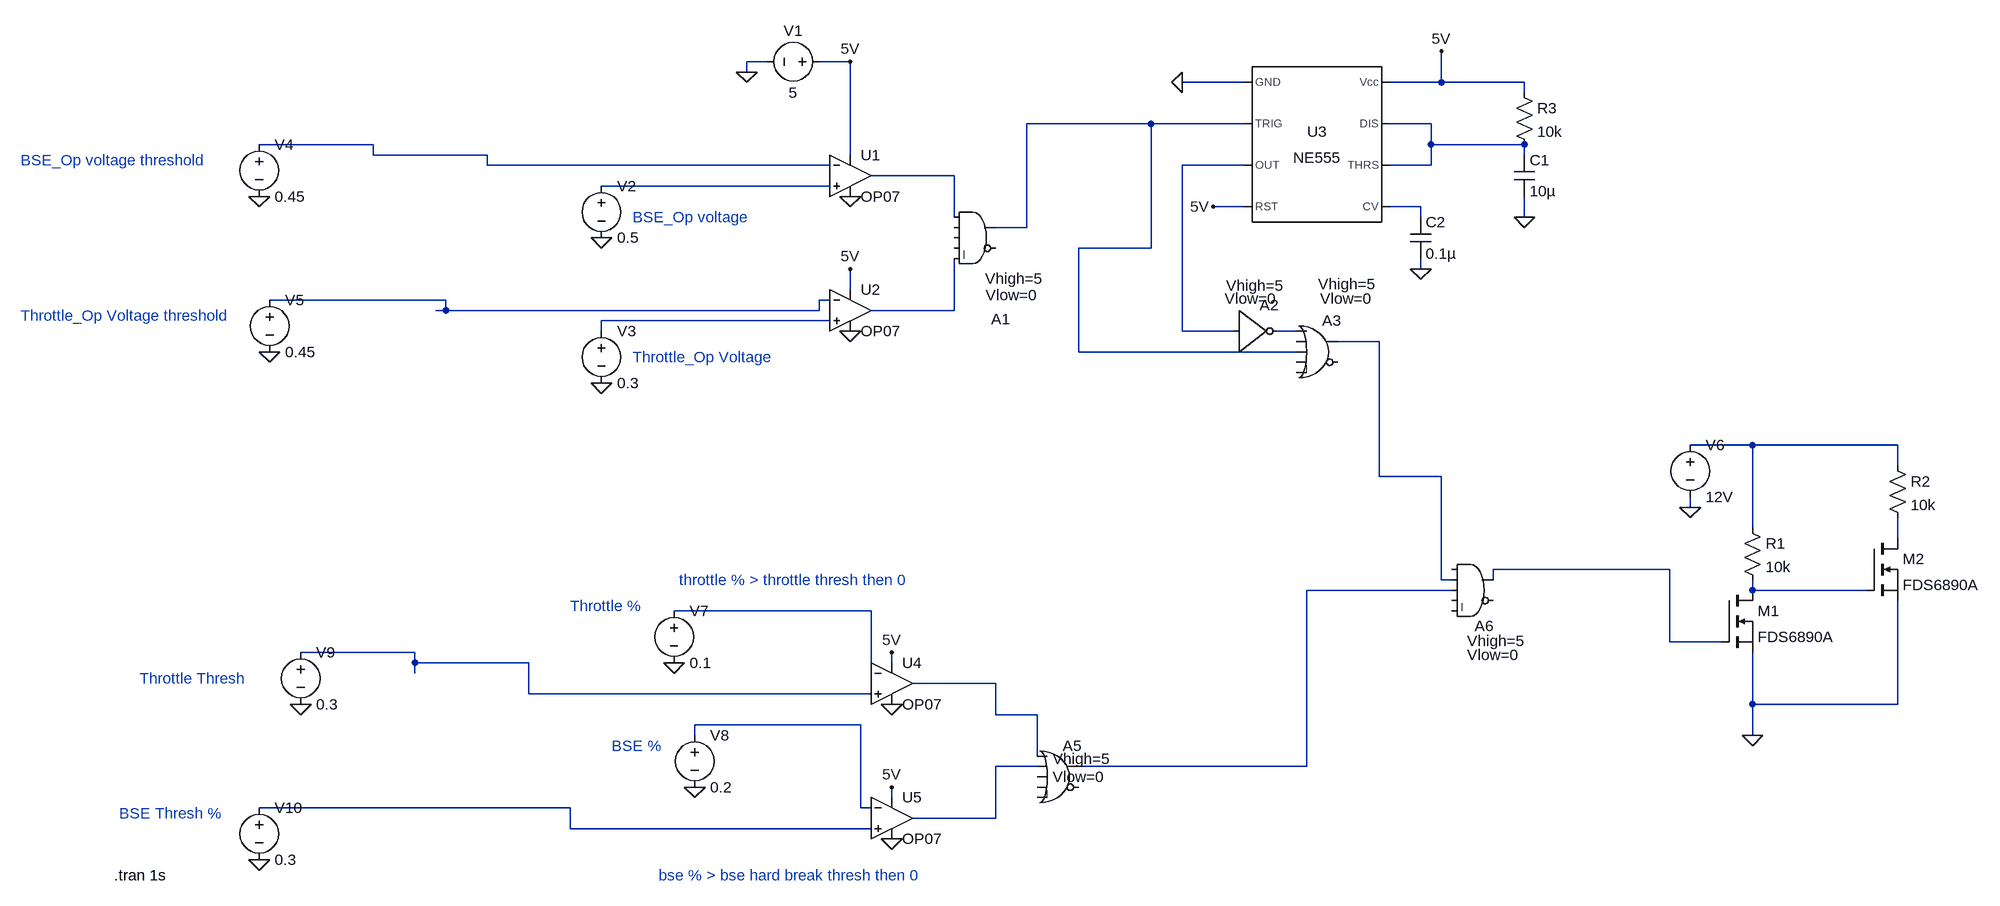
[diagram p0: schematic BSPD_Sim.asc]
BSPD_Sim.asc, the LTspice schematic file:
Version 4
SHEET 1 1992 1124
WIRE 0 -176 -32 -176
WIRE 128 -176 80 -176
WIRE -32 -160 -32 -176
WIRE 736 -144 640 -144
WIRE 1040 -144 1040 -192
WIRE 1040 -144 960 -144
WIRE 1168 -144 1040 -144
WIRE 1168 -128 1168 -144
WIRE 592 -80 400 -80
WIRE 736 -80 592 -80
WIRE 1024 -80 960 -80
WIRE -608 -48 -784 -48
WIRE 1024 -48 1024 -80
WIRE 1168 -48 1024 -48
WIRE -608 -32 -608 -48
WIRE -432 -32 -608 -32
WIRE 128 -32 128 -176
WIRE 1168 -32 1168 -48
WIRE -432 -16 -432 -32
WIRE 96 -16 -432 -16
WIRE 736 -16 640 -16
WIRE 1024 -16 1024 -48
WIRE 1024 -16 960 -16
WIRE 288 0 160 0
WIRE 96 16 -256 16
WIRE 736 48 688 48
WIRE 1008 48 960 48
WIRE 288 64 288 0
WIRE 1008 64 1008 48
WIRE 1168 64 1168 32
WIRE 400 80 400 -80
WIRE 400 80 352 80
WIRE 592 112 592 -80
WIRE 592 112 480 112
WIRE 1008 144 1008 128
WIRE 128 176 128 144
WIRE -496 192 -768 192
WIRE 96 192 80 192
WIRE -496 208 -496 192
WIRE -496 208 -512 208
WIRE 80 208 80 192
WIRE 80 208 -496 208
WIRE 288 208 288 128
WIRE 288 208 160 208
WIRE 96 224 -256 224
WIRE -256 240 -256 224
WIRE 640 240 640 -16
WIRE 720 240 640 240
WIRE 816 240 784 240
WIRE 944 256 880 256
WIRE 480 272 480 112
WIRE 816 272 480 272
WIRE 1520 416 1424 416
WIRE 1744 416 1520 416
WIRE 1744 448 1744 416
WIRE 944 464 944 256
WIRE 1040 464 944 464
WIRE 1424 512 1424 496
WIRE 1520 544 1520 416
WIRE 1744 560 1744 528
WIRE 1392 608 1120 608
WIRE 1040 624 1040 464
WIRE 1056 624 1040 624
WIRE 1120 624 1120 608
WIRE 1056 640 832 640
WIRE 1520 640 1520 624
WIRE 1696 640 1520 640
WIRE 160 672 -144 672
WIRE 1392 720 1392 608
WIRE 1472 720 1392 720
WIRE -544 736 -720 736
WIRE -544 752 -544 736
WIRE -368 752 -544 752
WIRE 192 752 192 736
WIRE -544 768 -544 752
WIRE 160 768 160 672
WIRE 352 784 224 784
WIRE -368 800 -368 752
WIRE 160 800 -368 800
WIRE 1520 816 1520 736
WIRE 1744 816 1744 656
WIRE 1744 816 1520 816
WIRE 352 832 352 784
WIRE 416 832 352 832
WIRE 144 848 -112 848
WIRE -112 864 -112 848
WIRE 1520 864 1520 816
WIRE 416 896 416 832
WIRE 416 912 352 912
WIRE 832 912 832 640
WIRE 832 912 480 912
WIRE 192 960 192 944
WIRE -304 976 -784 976
WIRE 144 976 144 848
WIRE 160 976 144 976
WIRE 352 992 352 912
WIRE 352 992 224 992
WIRE -304 1008 -304 976
WIRE 160 1008 -304 1008
FLAG 128 -176 5V
FLAG 128 144 5V
FLAG 128 32 0
FLAG -32 -160 0
FLAG 128 240 0
FLAG -256 320 0
FLAG -256 96 0
FLAG -784 32 0
FLAG -768 272 0
FLAG 192 816 0
FLAG 192 1024 0
FLAG -112 944 0
FLAG -144 752 0
FLAG -720 816 0
FLAG -784 1056 0
FLAG 192 736 5V
FLAG 192 944 5V
FLAG 1520 864 0
FLAG 1040 -192 5V
FLAG 1168 64 0
FLAG 640 -144 0
FLAG 1008 144 0
FLAG 688 48 5V
FLAG 1424 512 0
SYMBOL OpAmps\\OP07 128 -64 R0
SYMATTR InstName U1
SYMBOL OpAmps\\OP07 128 144 R0
SYMATTR InstName U2
SYMBOL voltage 96 -176 R90
WINDOW 0 -32 56 VBottom 2
WINDOW 3 32 56 VTop 2
SYMATTR InstName V1
SYMATTR Value 5
SYMBOL voltage -256 0 R0
WINDOW 123 0 0 Left 0
WINDOW 39 0 0 Left 0
SYMATTR InstName V2
SYMATTR Value 0.5
SYMBOL voltage -256 224 R0
WINDOW 123 0 0 Left 0
WINDOW 39 0 0 Left 0
SYMATTR InstName V3
SYMATTR Value 0.3
SYMBOL voltage -784 -64 R0
WINDOW 123 0 0 Left 0
WINDOW 39 0 0 Left 0
SYMATTR InstName V4
SYMATTR Value 0.45
SYMBOL voltage -768 176 R0
WINDOW 123 0 0 Left 0
WINDOW 39 0 0 Left 0
SYMATTR InstName V5
SYMATTR Value 0.45
SYMBOL OpAmps\\OP07 192 720 R0
SYMATTR InstName U4
SYMBOL OpAmps\\OP07 192 928 R0
SYMATTR InstName U5
SYMBOL voltage -144 656 R0
WINDOW 123 0 0 Left 0
WINDOW 39 0 0 Left 0
SYMATTR InstName V7
SYMATTR Value 0.1
SYMBOL voltage -112 848 R0
WINDOW 123 0 0 Left 0
WINDOW 39 0 0 Left 0
SYMATTR InstName V8
SYMATTR Value 0.2
SYMBOL voltage -720 720 R0
WINDOW 123 0 0 Left 0
WINDOW 39 0 0 Left 0
SYMATTR InstName V9
SYMATTR Value 0.3
SYMBOL voltage -784 960 R0
WINDOW 123 0 0 Left 0
WINDOW 39 0 0 Left 0
SYMATTR InstName V10
SYMATTR Value 0.3
SYMBOL Digital\\and 320 32 R0
WINDOW 39 16 127 Left 2
WINDOW 40 17 152 Left 2
WINDOW 0 25 189 Left 2
SYMATTR SpiceLine Vhigh=5
SYMATTR SpiceLine2 Vlow=0
SYMATTR InstName A1
SYMBOL Digital\\and 1088 576 R0
WINDOW 39 -8 142 Left 2
WINDOW 40 -8 164 Left 2
WINDOW 0 3 119 Left 2
SYMATTR SpiceLine Vhigh=5
SYMATTR SpiceLine2 Vlow=0
SYMATTR InstName A6
SYMBOL Digital\\or 448 864 R0
WINDOW 3 -8 36 Left 2
WINDOW 123 -8 64 Left 2
SYMATTR Value Vhigh=5
SYMATTR Value2 Vlow=0
SYMATTR InstName A5
SYMBOL nmos 1472 640 R0
SYMATTR InstName M1
SYMATTR Value FDS6890A
SYMBOL res 1504 528 R0
SYMATTR InstName R1
SYMATTR Value 10k
SYMBOL nmos 1696 560 R0
SYMATTR InstName M2
SYMATTR Value FDS6890A
SYMBOL Misc\\NE555 848 -48 R0
SYMATTR InstName U3
SYMBOL res 1152 -144 R0
SYMATTR InstName R3
SYMATTR Value 10k
SYMBOL cap 1152 -32 R0
SYMATTR InstName C1
SYMATTR Value 10µ
SYMBOL cap 992 64 R0
SYMATTR InstName C2
SYMATTR Value 0.1µ
SYMBOL Digital\\inv 720 176 R0
WINDOW 3 -12 -6 Left 2
WINDOW 123 -14 14 Left 2
SYMATTR Value Vhigh=5
SYMATTR Value2 Vlow=0
SYMATTR InstName A2
SYMBOL Digital\\or 848 208 R0
WINDOW 3 2 -41 Left 2
WINDOW 123 5 -18 Left 2
SYMATTR Value Vhigh=5
SYMATTR Value2 Vlow=0
SYMATTR InstName A3
SYMBOL voltage 1424 400 R0
SYMATTR InstName V6
SYMATTR Value 12V
SYMBOL res 1728 432 R0
SYMATTR InstName R2
SYMATTR Value 10k
TEXT -208 64 Left 2 ;BSE_Op voltage
TEXT -208 280 Left 2 ;Throttle_Op Voltage
TEXT -968 776 Left 2 ;Throttle Thresh
TEXT -1000 984 Left 2 ;BSE Thresh %
TEXT -1008 1080 Left 2 !.tran 1s
TEXT -304 664 Left 2 ;Throttle %
TEXT -240 880 Left 2 ;BSE %
TEXT -1152 -24 Left 2 ;BSE_Op voltage threshold
TEXT -1152 216 Left 2 ;Throttle_Op Voltage threshold
TEXT -136 624 Left 2 ;throttle % > throttle thresh then 0
TEXT -168 1080 Left 2 ;bse % > bse hard break thresh then 0

The netlist it stands for:
* BSPD_Sim.asc
XU1 N006 N003 5V 0 N005 LT1001  ; OP07, pins In+ In- V+ V- OUT
XU2 N010 N008 5V 0 N009 LT1001  ; OP07, pins In+ In- V+ V- OUT
V1 5V 0 5
V2 N006 0 0.5
V3 N010 0 0.3
V4 N003 0 0.45
V5 N008 0 0.45
XU4 N019 N018 5V 0 N020 LT1001  ; OP07, pins In+ In- V+ V- OUT
XU5 N023 N021 5V 0 N022 LT1001  ; OP07, pins In+ In- V+ V- OUT
V7 N018 0 0.1
V8 N021 0 0.2
V9 N019 0 0.3
V10 N023 0 0.3
A1 N005 0 0 0 N009 0 N001 0 AND Vhigh=5 Vlow=0
A6 0 N012 N016 0 0 0 N015 0 AND Vhigh=5 Vlow=0
A5 N020 N022 0 0 0 0 N016 0 OR Vhigh=5 Vlow=0
M1 N017 N015 0 0 FDS6890A
R1 N013 N017 10k
M2 N014 N017 0 0 FDS6890A
XU3 0 N001 N004 5V N007 N002 N002 5V NE555  ; pins GND TRIG OUT RST CV THRS DIS Vcc
R3 5V N002 10k
C1 N002 0 10µ
C2 N007 0 0.1µ
A2 N004 0 0 0 0 N011 0 0 BUF Vhigh=5 Vlow=0
A3 N011 0 N001 0 0 0 N012 0 OR Vhigh=5 Vlow=0
V6 N013 0 12V
R2 N013 N014 10k
.model NMOS NMOS
.model PMOS PMOS
.lib standard.mos
* BSE_Op voltage
* Throttle_Op Voltage
* Throttle Thresh
* BSE Thresh %
.tran 1s
* Throttle %
* BSE %
* BSE_Op voltage threshold
* Throttle_Op Voltage threshold
* throttle % > throttle thresh then 0
* bse % > bse hard break thresh then 0
.lib LTC.lib
.lib NE555.sub
.backanno
.end